# Altium project VENTUNOQ.PrjPcb (part 12 of 18)

## Sheet MICROCONTROLLER.SchDoc: Microcontroller
size A3; CompanyName: ARDUINO; Organization: ARDUINO; SheetNumber: 11; SheetTotal: 51; RevAuthor: Silvio Navaretti
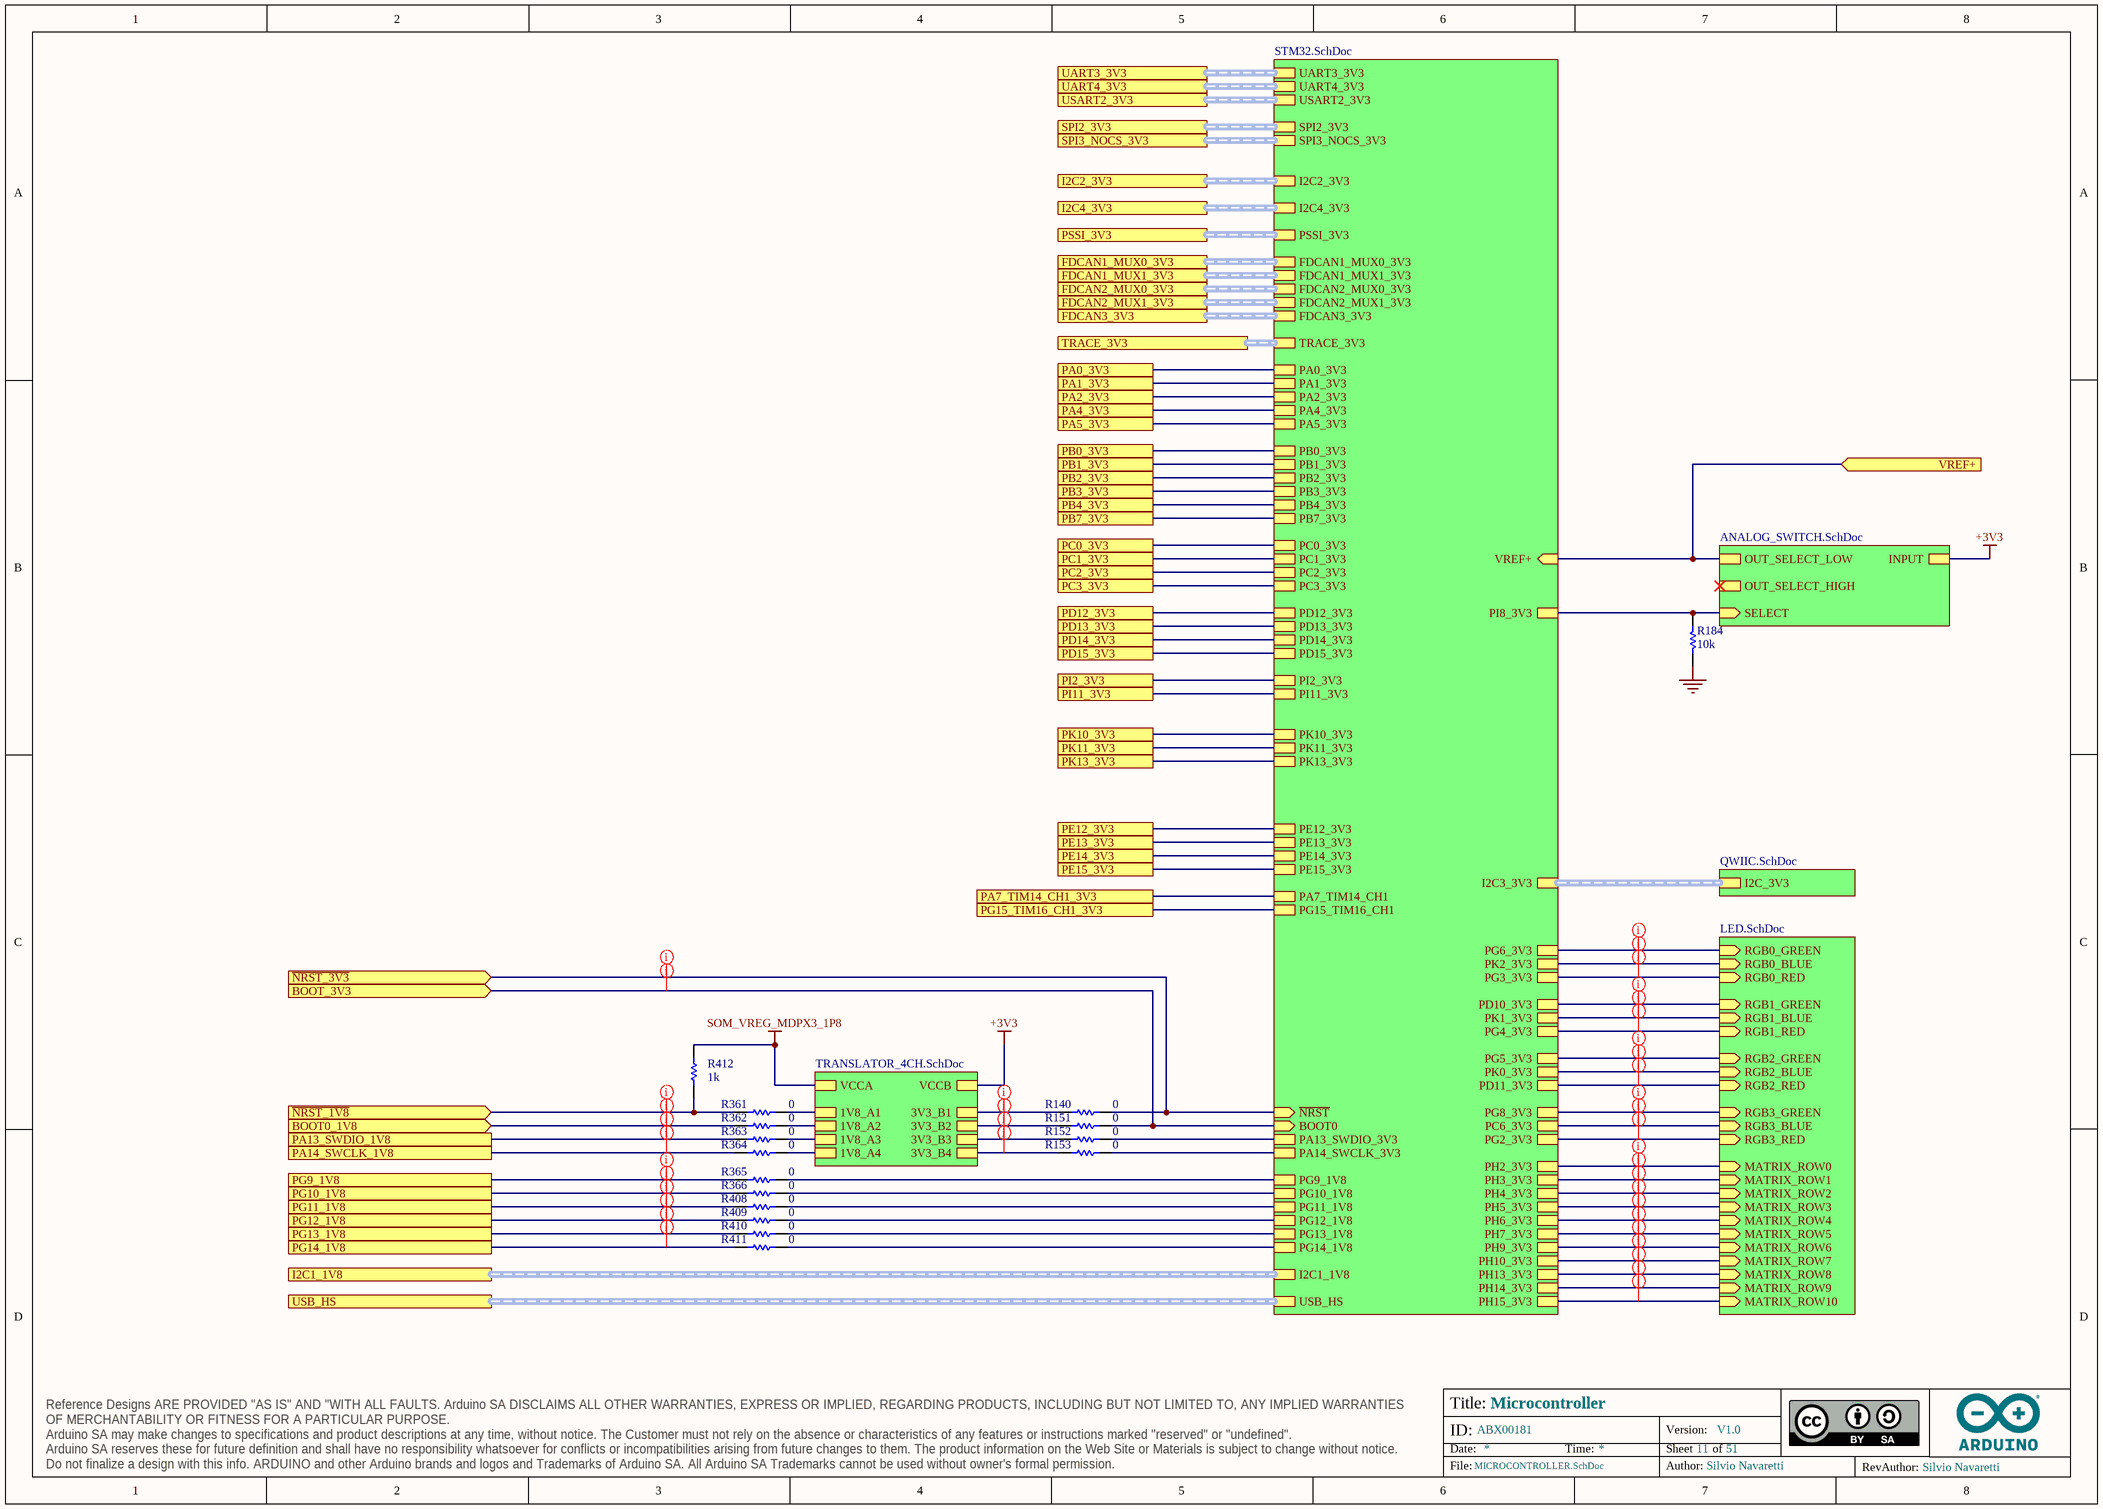
[diagram p36: MICROCONTROLLER.SchDoc]

### Parts
R140  value 0  [RES-0201]  (hidden comment: CRCW02010000Z0ED)
R151  value 0  [RES-0201]  (hidden comment: CRCW02010000Z0ED)
R152  value 0  [RES-0201]  (hidden comment: CRCW02010000Z0ED)
R153  value 0  [RES-0201]  (hidden comment: CRCW02010000Z0ED)
R184  value 10k  [RES-0201]  (hidden comment: RC0201FR-0710KL)
R361  value 0  [RES-0201]  (hidden comment: CRCW02010000Z0ED)
R362  value 0  [RES-0201]  (hidden comment: CRCW02010000Z0ED)
R363  value 0  [RES-0201]  (hidden comment: CRCW02010000Z0ED)
R364  value 0  [RES-0201]  (hidden comment: CRCW02010000Z0ED)
R365  value 0  [RES-0201]  (hidden comment: CRCW02010000Z0ED)
R366  value 0  [RES-0201]  (hidden comment: CRCW02010000Z0ED)
R408  value 0  [RES-0201]  (hidden comment: CRCW02010000Z0ED)
R409  value 0  [RES-0201]  (hidden comment: CRCW02010000Z0ED)
R410  value 0  [RES-0201]  (hidden comment: CRCW02010000Z0ED)
R411  value 0  [RES-0201]  (hidden comment: CRCW02010000Z0ED)
R412  value 1k  [RES-0201]  (hidden comment: RC0201FR-071KL)

### Sub-sheets
U_ANALOG_SWITCH = ANALOG_SWITCH.SchDoc: SELECT (in), OUT_SELECT_LOW, OUT_SELECT_HIGH, INPUT
U_LED = LED.SchDoc: RGB0_GREEN (in), RGB0_BLUE (in), RGB0_RED (in), RGB1_GREEN (in), RGB1_BLUE (in), RGB1_RED (in), RGB2_GREEN (in), RGB2_BLUE (in), RGB2_RED (in), RGB3_GREEN (in), RGB3_BLUE (in), RGB3_RED (in), MATRIX_ROW0 (in), MATRIX_ROW1 (in), MATRIX_ROW2 (in), MATRIX_ROW3 (in), MATRIX_ROW4 (in), MATRIX_ROW5 (in), MATRIX_ROW6 (in), MATRIX_ROW7 (in), MATRIX_ROW8 (in), MATRIX_ROW9 (in), MATRIX_ROW10 (in)
U_QWIIC = QWIIC.SchDoc: I2C_3V3 (harness I2C)
U_STM32 = STM32.SchDoc: USB_HS (harness SOM_MD_USB1), ~{NRST} (in), BOOT0 (in), UART3_3V3 (harness UART), PB2_3V3, PB3_3V3, FDCAN2_MUX0_3V3 (harness CAN), PB0_3V3, PB1_3V3, PB4_3V3, PB7_3V3, SPI2_3V3 (harness SPI), PA0_3V3, PA1_3V3, I2C2_3V3 (harness I2C), PA2_3V3, UART4_3V3 (harness UART), PSSI_3V3 (harness PSSI), PA4_3V3, PA5_3V3, PE12_3V3, PE13_3V3, PE14_3V3, PE15_3V3, FDCAN1_MUX0_3V3 (harness CAN), FDCAN2_MUX1_3V3 (harness CAN), PC0_3V3, PC1_3V3, PC2_3V3, PC3_3V3, PH2_3V3, PH3_3V3, PH4_3V3, PH5_3V3, PH6_3V3, PH7_3V3, PH9_3V3, PH13_3V3, PH14_3V3, PH15_3V3, VREF+ (in), SPI3_NOCS_3V3 (harness JSPI_SPI), I2C4_3V3 (harness I2C), PG9_1V8, PG10_1V8, PG11_1V8, PG12_1V8, PG13_1V8, PG14_1V8, I2C3_3V3 (harness I2C), I2C1_1V8 (harness I2C), PA13_SWDIO_3V3, PA14_SWCLK_3V3, TRACE_3V3 (harness MCU_TRACE), USART2_3V3 (harness UART), PA7_TIM14_CH1, PG15_TIM16_CH1, FDCAN3_3V3 (harness CAN), FDCAN1_MUX1_3V3 (harness CAN), PD12_3V3, PD13_3V3, PD14_3V3, PD15_3V3, PI2_3V3, PI11_3V3, PI8_3V3, PG2_3V3, PK0_3V3, PK1_3V3, PK2_3V3, PD10_3V3, PD11_3V3, PG3_3V3, PG4_3V3, PG5_3V3, PG6_3V3, PC6_3V3, PG8_3V3, PH10_3V3, PK13_3V3, PK10_3V3, PK11_3V3
U_TRANSLATOR_4CH = TRANSLATOR_4CH.SchDoc: 1V8_A1, 1V8_A2, 1V8_A3, 1V8_A4, 3V3_B1, 3V3_B2, 3V3_B3, 3V3_B4, VCCA, VCCB

### Ports
BOOT0_1V8 (in), BOOT_3V3 (in), FDCAN1_MUX0_3V3, FDCAN1_MUX1_3V3, FDCAN2_MUX0_3V3, FDCAN2_MUX1_3V3, FDCAN3_3V3, I2C1_1V8, I2C2_3V3, I2C4_3V3, PA0_3V3, PA1_3V3, PA2_3V3, PA4_3V3, PA5_3V3, PA7_TIM14_CH1_3V3, PA13_SWDIO_1V8, PA14_SWCLK_1V8, PB0_3V3, PB1_3V3, PB2_3V3, PB3_3V3, PB4_3V3, PB7_3V3, PC0_3V3, PC1_3V3, PC2_3V3, PC3_3V3, PD12_3V3, PD13_3V3, PD14_3V3, PD15_3V3, PE12_3V3, PE13_3V3, PE14_3V3, PE15_3V3, PG9_1V8, PG10_1V8, PG11_1V8, PG12_1V8, PG13_1V8, PG14_1V8, PG15_TIM16_CH1_3V3, PI2_3V3, PI11_3V3, PK10_3V3, PK11_3V3, PK13_3V3, PSSI_3V3, SPI2_3V3, SPI3_NOCS_3V3, TRACE_3V3, UART3_3V3, UART4_3V3, USART2_3V3, USB_HS, VREF+ (in), ~{NRST_1V8} (in), ~{NRST_3V3} (in)

### Nets
+3V3: sheet U_ANALOG_SWITCH/INPUT, sheet U_TRANSLATOR_4CH/VCCB
GND: R184.1
SOM_VREG_MDPX3_1P8: R412.1 ; sheet U_TRANSLATOR_4CH/VCCA
BOOT0: R151.1 ; port BOOT_3V3, sheet U_STM32/BOOT0
MD_GPIO_42: R408.2 ; port PG11_1V8
MD_GPIO_47: R362.2 ; port BOOT0_1V8
MD_GPIO_63: R409.2 ; port PG12_1V8
MD_GPIO_69: R365.2 ; port PG9_1V8
MD_GPIO_70: R363.2 ; port PA13_SWDIO_1V8
MD_GPIO_71: R364.2 ; port PA14_SWCLK_1V8
MD_GPIO_78: R361.2 R412.2 ; port ~{NRST_1V8}
MD_GPIO_92: R366.2 ; port PG10_1V8
MD_GPIO_95: R410.2 ; port PG13_1V8
MD_GPIO_96: R411.2 ; port PG14_1V8
NRST: R140.1 ; port ~{NRST_3V3}, sheet U_STM32/~{NRST}
PA0: port PA0_3V3, sheet U_STM32/PA0_3V3
PA1: port PA1_3V3, sheet U_STM32/PA1_3V3
PA2: port PA2_3V3, sheet U_STM32/PA2_3V3
PA4: port PA4_3V3, sheet U_STM32/PA4_3V3
PA5: port PA5_3V3, sheet U_STM32/PA5_3V3
PA7: port PA7_TIM14_CH1_3V3, sheet U_STM32/PA7_TIM14_CH1
PA13: R152.1 ; sheet U_STM32/PA13_SWDIO_3V3
PA14: R153.1 ; sheet U_STM32/PA14_SWCLK_3V3
PB0: port PB0_3V3, sheet U_STM32/PB0_3V3
PB1: port PB1_3V3, sheet U_STM32/PB1_3V3
PB2: port PB2_3V3, sheet U_STM32/PB2_3V3
PB3: port PB3_3V3, sheet U_STM32/PB3_3V3
PB4: port PB4_3V3, sheet U_STM32/PB4_3V3
PB7: port PB7_3V3, sheet U_STM32/PB7_3V3
PC0: port PC0_3V3, sheet U_STM32/PC0_3V3
PC1: port PC1_3V3, sheet U_STM32/PC1_3V3
PC2: port PC2_3V3, sheet U_STM32/PC2_3V3
PC3: port PC3_3V3, sheet U_STM32/PC3_3V3
PC6: sheet U_STM32/PC6_3V3, sheet U_LED/RGB3_BLUE
PD10: sheet U_STM32/PD10_3V3, sheet U_LED/RGB1_GREEN
PD11: sheet U_STM32/PD11_3V3, sheet U_LED/RGB2_RED
PD12: port PD12_3V3, sheet U_STM32/PD12_3V3
PD13: port PD13_3V3, sheet U_STM32/PD13_3V3
PD14: port PD14_3V3, sheet U_STM32/PD14_3V3
PD15: port PD15_3V3, sheet U_STM32/PD15_3V3
PE12: port PE12_3V3, sheet U_STM32/PE12_3V3
PE13: port PE13_3V3, sheet U_STM32/PE13_3V3
PE14: port PE14_3V3, sheet U_STM32/PE14_3V3
PE15: port PE15_3V3, sheet U_STM32/PE15_3V3
PG2: sheet U_STM32/PG2_3V3, sheet U_LED/RGB3_RED
PG3: sheet U_STM32/PG3_3V3, sheet U_LED/RGB0_RED
PG4: sheet U_STM32/PG4_3V3, sheet U_LED/RGB1_RED
PG5: sheet U_STM32/PG5_3V3, sheet U_LED/RGB2_GREEN
PG6: sheet U_STM32/PG6_3V3, sheet U_LED/RGB0_GREEN
PG8: sheet U_STM32/PG8_3V3, sheet U_LED/RGB3_GREEN
PG9: R365.1 ; sheet U_STM32/PG9_1V8
PG10: R366.1 ; sheet U_STM32/PG10_1V8
PG11: R408.1 ; sheet U_STM32/PG11_1V8
PG12: R409.1 ; sheet U_STM32/PG12_1V8
PG13: R410.1 ; sheet U_STM32/PG13_1V8
PG14: R411.1 ; sheet U_STM32/PG14_1V8
PG15: port PG15_TIM16_CH1_3V3, sheet U_STM32/PG15_TIM16_CH1
PH2: sheet U_STM32/PH2_3V3, sheet U_LED/MATRIX_ROW0
PH3: sheet U_STM32/PH3_3V3, sheet U_LED/MATRIX_ROW1
PH4: sheet U_STM32/PH4_3V3, sheet U_LED/MATRIX_ROW2
PH5: sheet U_STM32/PH5_3V3, sheet U_LED/MATRIX_ROW3
PH6: sheet U_STM32/PH6_3V3, sheet U_LED/MATRIX_ROW4
PH7: sheet U_STM32/PH7_3V3, sheet U_LED/MATRIX_ROW5
PH9: sheet U_STM32/PH9_3V3, sheet U_LED/MATRIX_ROW6
PH10: sheet U_STM32/PH10_3V3, sheet U_LED/MATRIX_ROW7
PH13: sheet U_STM32/PH13_3V3, sheet U_LED/MATRIX_ROW8
PH14: sheet U_STM32/PH14_3V3, sheet U_LED/MATRIX_ROW9
PH15: sheet U_STM32/PH15_3V3, sheet U_LED/MATRIX_ROW10
PI2: port PI2_3V3, sheet U_STM32/PI2_3V3
PI8: R184.2 ; sheet U_STM32/PI8_3V3, sheet U_ANALOG_SWITCH/SELECT
PI11: port PI11_3V3, sheet U_STM32/PI11_3V3
PK0: sheet U_STM32/PK0_3V3, sheet U_LED/RGB2_BLUE
PK1: sheet U_STM32/PK1_3V3, sheet U_LED/RGB1_BLUE
PK2: sheet U_STM32/PK2_3V3, sheet U_LED/RGB0_BLUE
PK10: port PK10_3V3, sheet U_STM32/PK10_3V3
PK11: port PK11_3V3, sheet U_STM32/PK11_3V3
PK13: port PK13_3V3, sheet U_STM32/PK13_3V3
NetC107_2: port VREF+, sheet U_STM32/VREF+, sheet U_ANALOG_SWITCH/OUT_SELECT_LOW
NetR140_2: R140.2 ; sheet U_TRANSLATOR_4CH/3V3_B1
NetR151_2: R151.2 ; sheet U_TRANSLATOR_4CH/3V3_B2
NetR152_2: R152.2 ; sheet U_TRANSLATOR_4CH/3V3_B3
NetR153_2: R153.2 ; sheet U_TRANSLATOR_4CH/3V3_B4
NetR361_1: R361.1 ; sheet U_TRANSLATOR_4CH/1V8_A1
NetR362_1: R362.1 ; sheet U_TRANSLATOR_4CH/1V8_A2
NetR363_1: R363.1 ; sheet U_TRANSLATOR_4CH/1V8_A3
NetR364_1: R364.1 ; sheet U_TRANSLATOR_4CH/1V8_A4

### Buses and harness runs
harness port FDCAN1_MUX0_3V3 = sheet U_STM32/FDCAN1_MUX0_3V3
harness port FDCAN1_MUX1_3V3 = sheet U_STM32/FDCAN1_MUX1_3V3
harness port FDCAN2_MUX0_3V3 = sheet U_STM32/FDCAN2_MUX0_3V3
harness port FDCAN2_MUX1_3V3 = sheet U_STM32/FDCAN2_MUX1_3V3
harness port FDCAN3_3V3 = sheet U_STM32/FDCAN3_3V3
harness port I2C1_1V8 = sheet U_STM32/I2C1_1V8
harness port I2C2_3V3 = sheet U_STM32/I2C2_3V3
harness port I2C4_3V3 = sheet U_STM32/I2C4_3V3
harness port PSSI_3V3 = sheet U_STM32/PSSI_3V3
harness port SPI2_3V3 = sheet U_STM32/SPI2_3V3
harness port SPI3_NOCS_3V3 = sheet U_STM32/SPI3_NOCS_3V3
harness port TRACE_3V3 = sheet U_STM32/TRACE_3V3
harness port UART3_3V3 = sheet U_STM32/UART3_3V3
harness port UART4_3V3 = sheet U_STM32/UART4_3V3
harness port USART2_3V3 = sheet U_STM32/USART2_3V3
harness port USB_HS = sheet U_STM32/USB_HS
harness sheet U_QWIIC/I2C_3V3 = sheet U_STM32/I2C3_3V3

### Layout directives
net class MICROCONTROLLER: BOOT0, MD_GPIO_42, MD_GPIO_47, MD_GPIO_63, MD_GPIO_69, MD_GPIO_70, MD_GPIO_71, MD_GPIO_78, MD_GPIO_92, MD_GPIO_95, MD_GPIO_96, NetR140_2, NetR151_2, NetR152_2, NetR153_2, NRST
net class MICROCONTROLLER_RGB: PC6, PD10, PD11, PG2, PG3, PG4, PG5, PG6, PG8, PK0, PK1, PK2
net class MICROCONTROLLER_MATRIX: PH2, PH3, PH4, PH5, PH6, PH7, PH9, PH10, PH13, PH14, PH15

### Notes on the sheet
- Title:
- ID:
- Date:
- Time:
- Version:
- Sheet
- of
- RevAuthor:
- Reference Designs ARE PROVIDED "AS IS" AND "WITH ALL FAULTS. Arduino SA DISCLAIMS ALL OTHER WARRANTIES, EXPRESS OR IMPLIED, REGARDING PRODUCTS, INCLUDING BUT NOT LIMITED TO, ANY IMPLIED WARRANTIES OF MERCHANTABILITY OR FITNESS FOR A PARTICULAR PURPOSE.
  Arduino SA may make changes to specifications and product descriptions at any time, without notice. The Customer must not rely on the absence or characteristics of any features or instructions marked "reserved" or "undefined".
  Arduino SA reserves these for future definition and shall have no responsibility whatsoever for conflicts or incompatibilities arising from future changes to them. The product information on the Web Site or Materials is subject to change without notice.
  Do not finalize a design with this info. ARDUINO and other Arduino brands and logos and Trademarks of Arduino SA. All Arduino SA Trademarks cannot be used without owner's formal permission.
- File:
- Author:

### Library data of the parts
R140 R151-R153 R361-R366 R408-R411 = R0140-A.21: RES CHIP 0201 0R; Manufacturer: Vishay; Temperature coefficient: 0ppm; Code Arduino: R0140; Power: 50mW; Tolerance: 0%; Technology: Thick film; Case Code (Imperial): 0201; Part Number: CRCW02010000Z0ED
R184 = R0145-A.21: RES CHIP 0201 10k 1% 1/20W; Manufacturer: Yageo; Power: 50mW; Temperature coefficient: 200ppm; Code Arduino: R0145; Manufacturer 2: Samsung Electro-Mechanics; Tolerance: 1%; Case Code (Imperial): 0201; Part Number: RC0201FR-0710KL; Technology: Thick film
R412 = R0195-A.22: RES CHIP 0201 1k 1% 1/20W; Manufacturer: Yageo; Power: 50mW; Temperature coefficient: 200ppm; Code Arduino: R0195; Tolerance: 1%; Case Code (Imperial): 0201; Part Number: RC0201FR-071KL; Technology: Thick film

## Sheet STM32.SchDoc: STM32
size A3; Author: Silvio Navaretti; CompanyName: ARDUINO; DrawnBy: Silvio Navaretti; Engineer: Silvio Navaretti; Organization: ARDUINO; SheetNumber: 12; SheetTotal: 51; RevAuthor: Silvio Navaretti
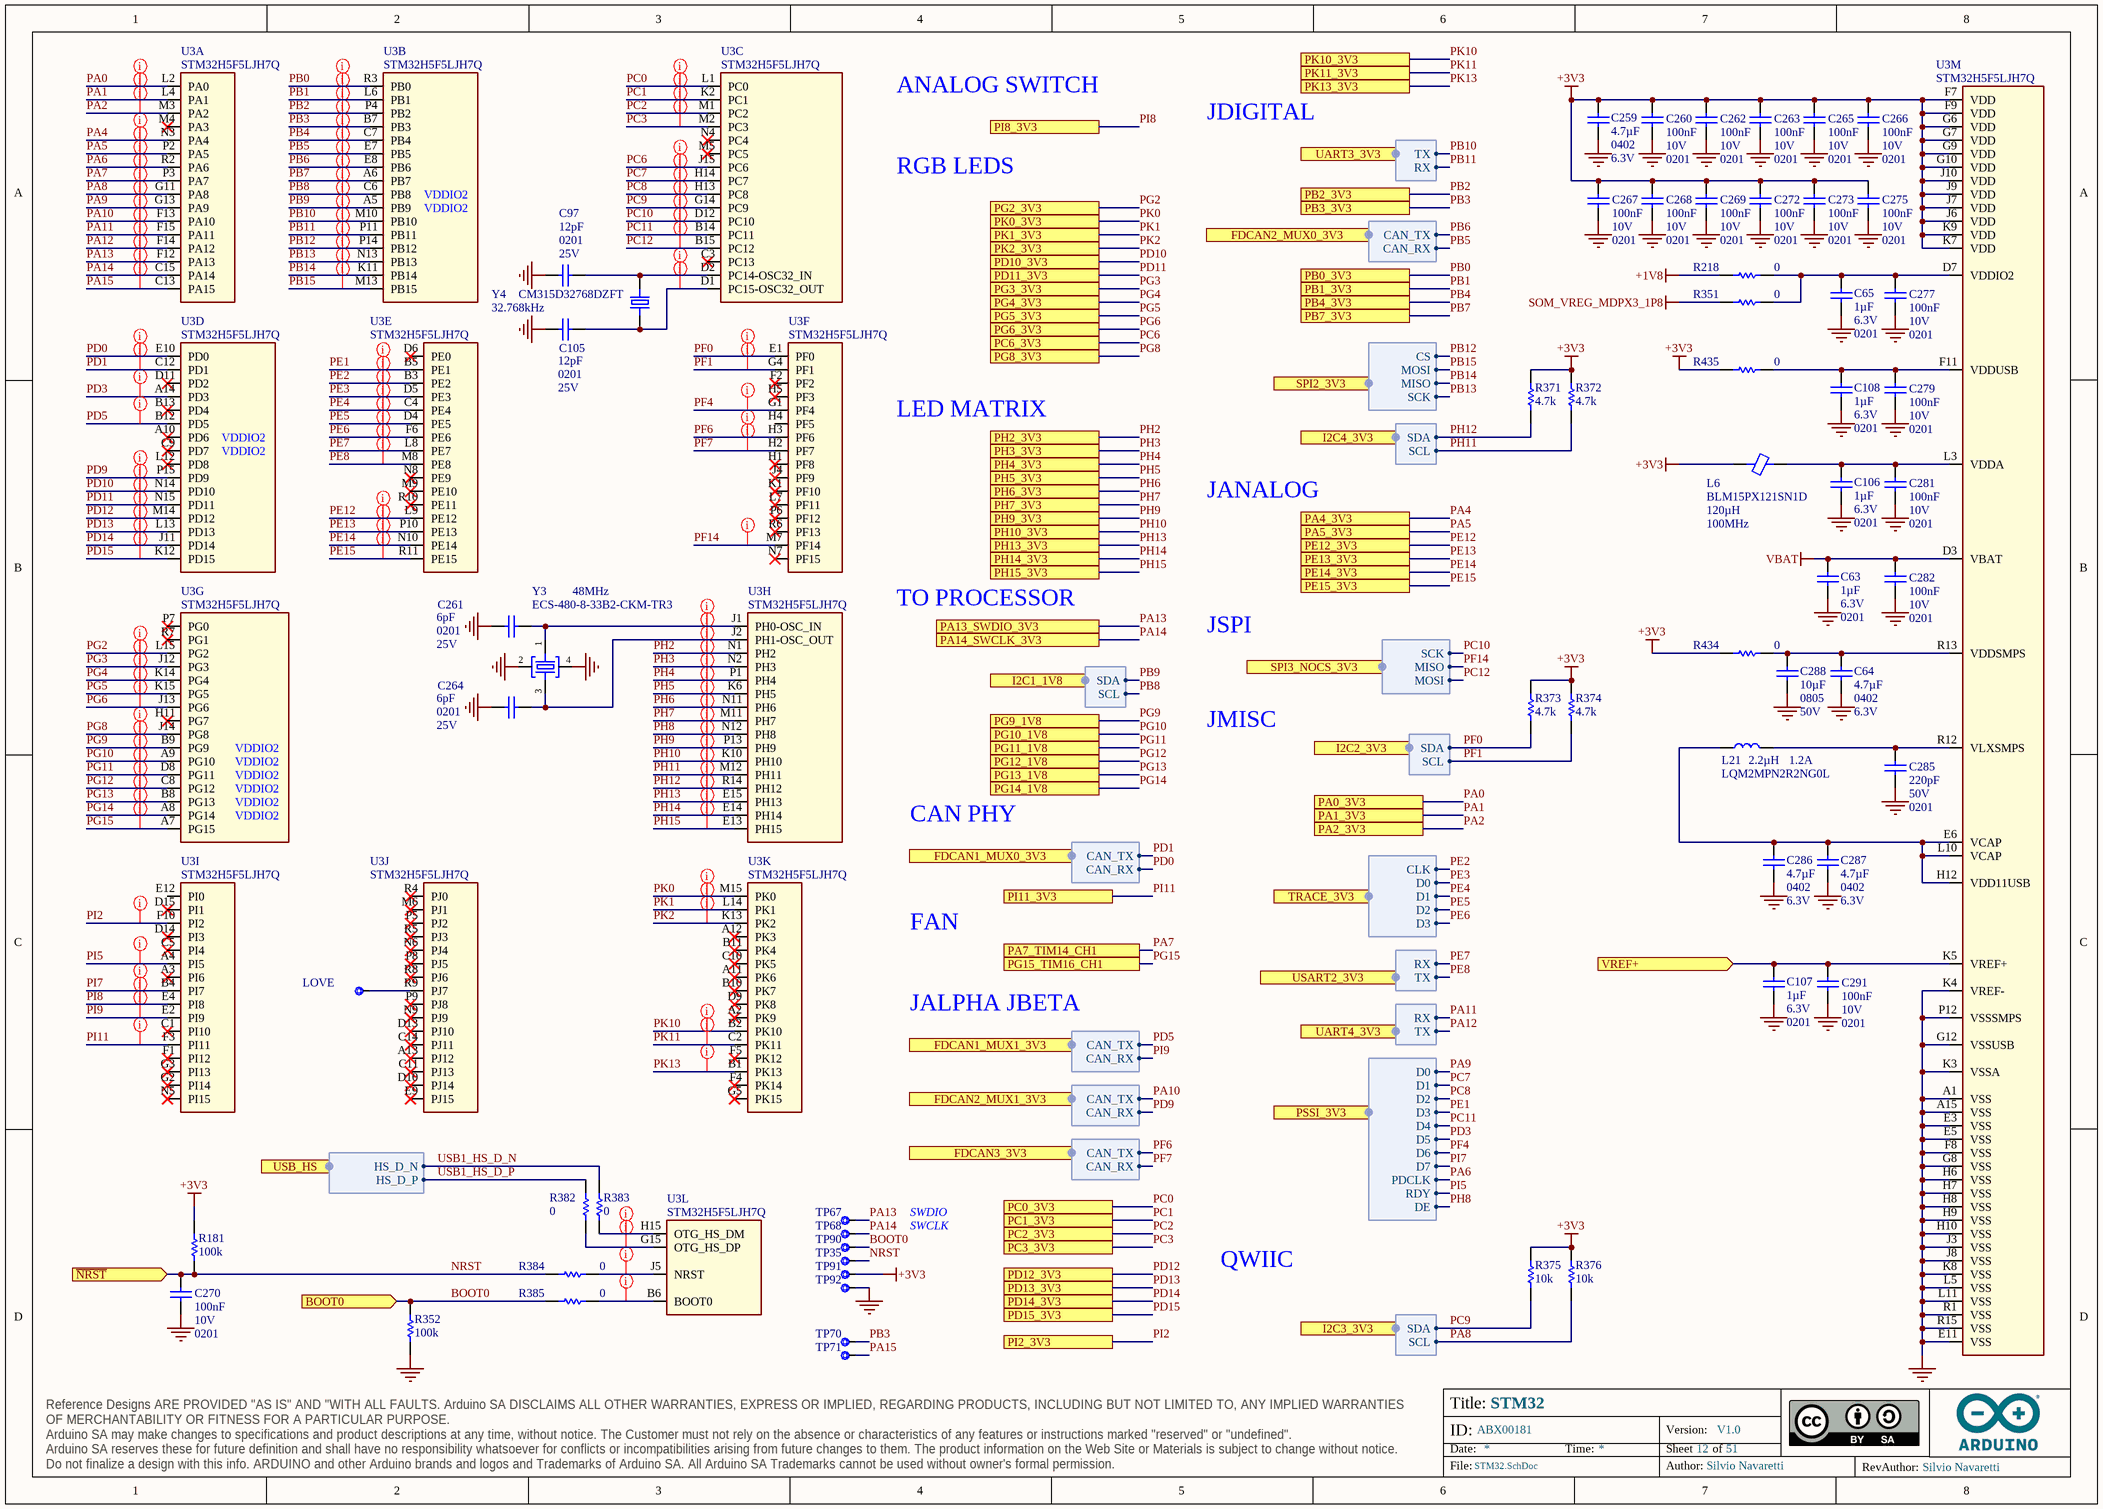
[diagram p37: STM32.SchDoc]

### Parts
C63  value 1µF  Voltage: 6.3V  Case Code (Imperial): 0201  [CAP-0201]  (hidden comment: GRM033R60J105MEA2D)
C64  value 4.7µF  Case Code (Imperial): 0402  Voltage: 6.3V  [CAP-0402]  (hidden comment: C1005A475M6R3NT)
C65  value 1µF  Voltage: 6.3V  Case Code (Imperial): 0201  [CAP-0201]  (hidden comment: GRM033R60J105MEA2D)
C97  value 12pF  Case Code (Imperial): 0201  Voltage: 25V  [CAP-0201]  (hidden comment: GRM0335C1E120JA01J)
C105  value 12pF  Case Code (Imperial): 0201  Voltage: 25V  [CAP-0201]  (hidden comment: GRM0335C1E120JA01J)
C106  value 1µF  Voltage: 6.3V  Case Code (Imperial): 0201  [CAP-0201]  (hidden comment: GRM033R60J105MEA2D)
C107  value 1µF  Voltage: 6.3V  Case Code (Imperial): 0201  [CAP-0201]  (hidden comment: GRM033R60J105MEA2D)
C108  value 1µF  Voltage: 6.3V  Case Code (Imperial): 0201  [CAP-0201]  (hidden comment: GRM033R60J105MEA2D)
C259  value 4.7µF  Case Code (Imperial): 0402  Voltage: 6.3V  [CAP-0402]  (hidden comment: C1005A475M6R3NT)
C260  value 100nF  Voltage: 10V  Case Code (Imperial): 0201  [CAP-0201]  (hidden comment: CL03A104KP3NNNC)
C261  value 6pF  Case Code (Imperial): 0201  Voltage: 25V  [CAP-0201]  (hidden comment: GRM0335C1E6R0CA01D)
C262  value 100nF  Voltage: 10V  Case Code (Imperial): 0201  [CAP-0201]  (hidden comment: CL03A104KP3NNNC)
C263  value 100nF  Voltage: 10V  Case Code (Imperial): 0201  [CAP-0201]  (hidden comment: CL03A104KP3NNNC)
C264  value 6pF  Case Code (Imperial): 0201  Voltage: 25V  [CAP-0201]  (hidden comment: GRM0335C1E6R0CA01D)
C265  value 100nF  Voltage: 10V  Case Code (Imperial): 0201  [CAP-0201]  (hidden comment: CL03A104KP3NNNC)
C266  value 100nF  Voltage: 10V  Case Code (Imperial): 0201  [CAP-0201]  (hidden comment: CL03A104KP3NNNC)
C267  value 100nF  Voltage: 10V  Case Code (Imperial): 0201  [CAP-0201]  (hidden comment: CL03A104KP3NNNC)
C268  value 100nF  Voltage: 10V  Case Code (Imperial): 0201  [CAP-0201]  (hidden comment: CL03A104KP3NNNC)
C269  value 100nF  Voltage: 10V  Case Code (Imperial): 0201  [CAP-0201]  (hidden comment: CL03A104KP3NNNC)
C270  value 100nF  Voltage: 10V  Case Code (Imperial): 0201  [CAP-0201]  (hidden comment: CL03A104KP3NNNC)
C272  value 100nF  Voltage: 10V  Case Code (Imperial): 0201  [CAP-0201]  (hidden comment: CL03A104KP3NNNC)
C273  value 100nF  Voltage: 10V  Case Code (Imperial): 0201  [CAP-0201]  (hidden comment: CL03A104KP3NNNC)
C275  value 100nF  Voltage: 10V  Case Code (Imperial): 0201  [CAP-0201]  (hidden comment: CL03A104KP3NNNC)
C277  value 100nF  Voltage: 10V  Case Code (Imperial): 0201  [CAP-0201]  (hidden comment: CL03A104KP3NNNC)
C279  value 100nF  Voltage: 10V  Case Code (Imperial): 0201  [CAP-0201]  (hidden comment: CL03A104KP3NNNC)
C281  value 100nF  Voltage: 10V  Case Code (Imperial): 0201  [CAP-0201]  (hidden comment: CL03A104KP3NNNC)
C282  value 100nF  Voltage: 10V  Case Code (Imperial): 0201  [CAP-0201]  (hidden comment: CL03A104KP3NNNC)
C285  value 220pF  Voltage: 50V  Case Code (Imperial): 0201  [CAP-0201]  (hidden comment: GRM033R71H221KA12D)
C286  value 4.7µF  Case Code (Imperial): 0402  Voltage: 6.3V  [CAP-0402]  (hidden comment: C1005A475M6R3NT)
C287  value 4.7µF  Case Code (Imperial): 0402  Voltage: 6.3V  [CAP-0402]  (hidden comment: C1005A475M6R3NT)
C288  value 10µF  Case Code (Imperial): 0805  Voltage: 50V  [CAP-0805]  (hidden comment: GRM21BR61H106ME43L)
C291  value 100nF  Voltage: 10V  Case Code (Imperial): 0201  [CAP-0201]  (hidden comment: CL03A104KP3NNNC)
L6  BLM15PX121SN1D  Inductance: 120µH  Test Frequency: 100MHz  [L-0402]
L21  LQM2MPN2R2NG0L  Current: 1.2A  Inductance: 2.2µH  [LQM2MPN2R2NG0L]
LOVE  Test point 1.00mm  [TP-1.00MM]  (value not drawn)  (no BOM)
R181  value 100k  [RES-0201]  (hidden comment: RC0201FR-07100KL)
R218  value 0  [RES-0201]  (hidden comment: CRCW02010000Z0ED)
R351  value 0  [RES-0201]  (hidden comment: CRCW02010000Z0ED)
R352  value 100k  [RES-0201]  (hidden comment: RC0201FR-07100KL)
R371  value 4.7k  [RES-0201]  (hidden comment: RC0201FR-074K7L)
R372  value 4.7k  [RES-0201]  (hidden comment: RC0201FR-074K7L)
R373  value 4.7k  [RES-0201]  (hidden comment: RC0201FR-074K7L)
R374  value 4.7k  [RES-0201]  (hidden comment: RC0201FR-074K7L)
R375  value 10k  [RES-0201]  (hidden comment: RC0201FR-0710KL)
R376  value 10k  [RES-0201]  (hidden comment: RC0201FR-0710KL)
R382  value 0  [RES-0201]  (hidden comment: CRCW02010000Z0ED)
R383  value 0  [RES-0201]  (hidden comment: CRCW02010000Z0ED)
R384  value 0  [RES-0201]  (hidden comment: CRCW02010000Z0ED)
R385  value 0  [RES-0201]  (hidden comment: CRCW02010000Z0ED)
R434  value 0  [RES-0201]  (hidden comment: CRCW02010000Z0ED)
R435  value 0  [RES-0201]  (hidden comment: CRCW02010000Z0ED)
TP35  Test point 1.00mm  [TP-1.00MM]  (value not drawn)  (no BOM)
TP67  Test point 1.00mm  [TP-1.00MM]  (value not drawn)  (no BOM)
TP68  Test point 1.00mm  [TP-1.00MM]  (value not drawn)  (no BOM)
TP70  Test point 1.00mm  [TP-1.00MM]  (value not drawn)  (no BOM)
TP71  Test point 1.00mm  [TP-1.00MM]  (value not drawn)  (no BOM)
TP90  Test point 1.00mm  [TP-1.00MM]  (value not drawn)  (no BOM)
TP91  Test point 1.00mm  [TP-1.00MM]  (value not drawn)  (no BOM)
TP92  Test point 1.00mm  [TP-1.00MM]  (value not drawn)  (no BOM)
U3  STM32H5F5LJH7Q  [BGA225C80P15X15_1300X1300X120]  (parts A,B,C,D,E,F,G,H,I,J,K,L,M of 13)
Y3  ECS-480-8-33B2-CKM-TR3  Frequency: 48MHz  [CRYSTAL3.2X2.5]
Y4  CM315D32768DZFT  Frequency: 32.768kHz  [ABS07]

### Ports
BOOT0 (in), FDCAN1_MUX0_3V3 (harness CAN), FDCAN1_MUX1_3V3 (harness CAN), FDCAN2_MUX0_3V3 (harness CAN), FDCAN2_MUX1_3V3 (harness CAN), FDCAN3_3V3 (harness CAN), I2C1_1V8 (harness I2C), I2C2_3V3 (harness I2C), I2C3_3V3 (harness I2C), I2C4_3V3 (harness I2C), PA0_3V3, PA1_3V3, PA2_3V3, PA4_3V3, PA5_3V3, PA7_TIM14_CH1, PA13_SWDIO_3V3, PA14_SWCLK_3V3, PB0_3V3, PB1_3V3, PB2_3V3, PB3_3V3, PB4_3V3, PB7_3V3, PC0_3V3, PC1_3V3, PC2_3V3, PC3_3V3, PC6_3V3, PD10_3V3, PD11_3V3, PD12_3V3, PD13_3V3, PD14_3V3, PD15_3V3, PE12_3V3, PE13_3V3, PE14_3V3, PE15_3V3, PG2_3V3, PG3_3V3, PG4_3V3, PG5_3V3, PG6_3V3, PG8_3V3, PG9_1V8, PG10_1V8, PG11_1V8, PG12_1V8, PG13_1V8, PG14_1V8, PG15_TIM16_CH1, PH2_3V3, PH3_3V3, PH4_3V3, PH5_3V3, PH6_3V3, PH7_3V3, PH9_3V3, PH10_3V3, PH13_3V3, PH14_3V3, PH15_3V3, PI2_3V3, PI8_3V3, PI11_3V3, PK0_3V3, PK1_3V3, PK2_3V3, PK10_3V3, PK11_3V3, PK13_3V3, PSSI_3V3 (harness PSSI), SPI2_3V3 (harness SPI), SPI3_NOCS_3V3 (harness JSPI_SPI), TRACE_3V3 (harness MCU_TRACE), UART3_3V3 (harness UART), UART4_3V3 (harness UART), USART2_3V3 (harness UART), USB_HS (harness SOM_MD_USB1), VREF+ (in), ~{NRST} (in)

### Harnesses
SPI: SCK, MISO, MOSI, CS
UART: TX, RX
I2C: SDA, SCL
CAN: CAN_TX, CAN_RX
PSSI: D0, D1, D2, D3, D4, D5, D6, D7, PDCLK, RDY, DE
JSPI_SPI: SCK, MISO, MOSI
MCU_TRACE: CLK, D0, D1, D2, D3
SOM_MD_USB1: HS_D_P, HS_D_N

### Nets
+1V8: R218.1
+3V3: C259.1 C260.2 C262.2 C263.2 C265.2 C266.2 C267.2 C268.2 C269.2 C272.2 C273.2 C275.2 L6.1 R181.2 R371.2 R372.2 R373.2 R374.2 R375.2 R376.2 R434.1 R435.1 TP91.X U3.F7(VDD) U3.F9(VDD) U3.G6(VDD) U3.G7(VDD) U3.G9(VDD) U3.G10(VDD) U3.J6(VDD) U3.J7(VDD) U3.J9(VDD) U3.J10(VDD) U3.K7(VDD) U3.K9(VDD)
GND: C63.1 C64.2 C65.1 C97.2 C105.2 C106.1 C107.1 C108.1 C259.2 C260.1 C261.2 C262.1 C263.1 C264.2 C265.1 C266.1 C267.1 C268.1 C269.1 C270.1 C272.1 C273.1 C275.1 C277.1 C279.1 C281.1 C282.1 C285.1 C286.2 C287.2 C288.2 C291.1 R352.1 TP92.X U3.A1(VSS) U3.A15(VSS) U3.E3(VSS) U3.E5(VSS) U3.E11(VSS) U3.F8(VSS) U3.G8(VSS) U3.G12(VSSUSB) U3.H6(VSS) U3.H7(VSS) U3.H8(VSS) U3.H9(VSS) U3.H10(VSS) U3.J3(VSS) U3.J8(VSS) U3.K3(VSSA) U3.K4(VREF-) U3.K8(VSS) U3.L5(VSS) U3.L11(VSS) U3.P12(VSSSMPS) U3.R1(VSS) U3.R15(VSS) Y3.2 Y3.4
SOM_VREG_MDPX3_1P8: R351.1
VBAT: C63.2 C282.2 U3.D3(VBAT)
BOOT0: R352.2 R385.1 TP90.X ; port BOOT0
NRST: C270.2 R181.1 R384.1 TP35.X ; port ~{NRST}
PA0: U3.L2(PA0) ; port PA0_3V3
PA1: U3.L4(PA1) ; port PA1_3V3
PA2: U3.M3(PA2) ; port PA2_3V3
PA4: U3.N3(PA4) ; port PA4_3V3
PA5: U3.P2(PA5) ; port PA5_3V3
PA6: U3.R2(PA6) ; port PSSI_3V3.PDCLK
PA7: U3.P3(PA7) ; port PA7_TIM14_CH1
PA8: R376.1 U3.G11(PA8) ; port I2C3_3V3.SCL
PA9: U3.G13(PA9) ; port PSSI_3V3.D0
PA10: U3.F13(PA10) ; port FDCAN2_MUX1_3V3.CAN_TX
PA11: U3.F15(PA11) ; port UART4_3V3.RX
PA12: U3.F14(PA12) ; port UART4_3V3.TX
PA13: TP67.X U3.F12(PA13) ; port PA13_SWDIO_3V3
PA14: TP68.X U3.C15(PA14) ; port PA14_SWCLK_3V3
PA15: TP71.X U3.C13(PA15)  [project net PA15_12]
PB0: U3.R3(PB0) ; port PB0_3V3
PB1: U3.L6(PB1) ; port PB1_3V3
PB2: U3.P4(PB2) ; port PB2_3V3
PB3: TP70.X U3.B7(PB3) ; port PB3_3V3
PB4: U3.C7(PB4) ; port PB4_3V3
PB5: U3.E7(PB5) ; port FDCAN2_MUX0_3V3.CAN_RX
PB6: U3.E8(PB6) ; port FDCAN2_MUX0_3V3.CAN_TX
PB7: U3.A6(PB7) ; port PB7_3V3
PB8: U3.C6(PB8) ; port I2C1_1V8.SCL  [project net MD_CCI_I2C3.SCL]
PB9: U3.A5(PB9) ; port I2C1_1V8.SDA  [project net MD_CCI_I2C3.SDA]
PB10: U3.M10(PB10) ; port UART3_3V3.TX
PB11: U3.P11(PB11) ; port UART3_3V3.RX
PB12: U3.P14(PB12) ; port SPI2_3V3.CS
PB13: U3.N13(PB13) ; port SPI2_3V3.SCK
PB14: U3.K11(PB14) ; port SPI2_3V3.MISO
PB15: U3.M13(PB15) ; port SPI2_3V3.MOSI
PC0: U3.L1(PC0) ; port PC0_3V3
PC1: U3.K2(PC1) ; port PC1_3V3
PC2: U3.M1(PC2) ; port PC2_3V3
PC3: U3.M2(PC3) ; port PC3_3V3
PC6: U3.J15(PC6) ; port PC6_3V3
PC7: U3.H14(PC7) ; port PSSI_3V3.D1
PC8: U3.H13(PC8) ; port PSSI_3V3.D2
PC9: R375.1 U3.G14(PC9) ; port I2C3_3V3.SDA
PC10: U3.D12(PC10) ; port SPI3_NOCS_3V3.SCK
PC11: U3.B14(PC11) ; port PSSI_3V3.D4
PC12: U3.B15(PC12) ; port SPI3_NOCS_3V3.MOSI
PD0: U3.E10(PD0) ; port FDCAN1_MUX0_3V3.CAN_RX
PD1: U3.C12(PD1) ; port FDCAN1_MUX0_3V3.CAN_TX
PD3: U3.A14(PD3) ; port PSSI_3V3.D5
PD5: U3.B12(PD5) ; port FDCAN1_MUX1_3V3.CAN_TX
PD9: U3.P15(PD9) ; port FDCAN2_MUX1_3V3.CAN_RX
PD10: U3.N14(PD10) ; port PD10_3V3
PD11: U3.N15(PD11) ; port PD11_3V3
PD12: U3.M14(PD12) ; port PD12_3V3
PD13: U3.L13(PD13) ; port PD13_3V3
PD14: U3.J11(PD14) ; port PD14_3V3
PD15: U3.K12(PD15) ; port PD15_3V3
PE1: U3.B5(PE1) ; port PSSI_3V3.D3
PE2: U3.B3(PE2) ; port TRACE_3V3.CLK
PE3: U3.D5(PE3) ; port TRACE_3V3.D0
PE4: U3.C4(PE4) ; port TRACE_3V3.D1
PE5: U3.D4(PE5) ; port TRACE_3V3.D2
PE6: U3.F6(PE6) ; port TRACE_3V3.D3
PE7: U3.L8(PE7) ; port USART2_3V3.RX
PE8: U3.M8(PE8) ; port USART2_3V3.TX
PE12: U3.L9(PE12) ; port PE12_3V3
PE13: U3.P10(PE13) ; port PE13_3V3
PE14: U3.N10(PE14) ; port PE14_3V3
PE15: U3.R11(PE15) ; port PE15_3V3
PF0: R373.1 U3.E1(PF0) ; port I2C2_3V3.SDA
PF1: R374.1 U3.G4(PF1) ; port I2C2_3V3.SCL
PF4: U3.G1(PF4) ; port PSSI_3V3.D6
PF6: U3.H3(PF6) ; port FDCAN3_3V3.CAN_TX
PF7: U3.H2(PF7) ; port FDCAN3_3V3.CAN_RX
PF14: U3.M7(PF14) ; port SPI3_NOCS_3V3.MISO
PG2: U3.L15(PG2) ; port PG2_3V3
PG3: U3.J12(PG3) ; port PG3_3V3
PG4: U3.K14(PG4) ; port PG4_3V3
PG5: U3.K15(PG5) ; port PG5_3V3
PG6: U3.J13(PG6) ; port PG6_3V3
PG8: U3.J14(PG8) ; port PG8_3V3
PG9: U3.B9(PG9) ; port PG9_1V8
PG10: U3.A9(PG10) ; port PG10_1V8
PG11: U3.D8(PG11) ; port PG11_1V8
PG12: U3.C8(PG12) ; port PG12_1V8
PG13: U3.B8(PG13) ; port PG13_1V8
PG14: U3.A8(PG14) ; port PG14_1V8
PG15: U3.A7(PG15) ; port PG15_TIM16_CH1
PH2: U3.N1(PH2) ; port PH2_3V3
PH3: U3.N2(PH3) ; port PH3_3V3
PH4: U3.P1(PH4) ; port PH4_3V3
PH5: U3.K6(PH5) ; port PH5_3V3
PH6: U3.N11(PH6) ; port PH6_3V3
PH7: U3.M11(PH7) ; port PH7_3V3
PH8: U3.N12(PH8) ; port PSSI_3V3.DE
PH9: U3.P13(PH9) ; port PH9_3V3
PH10: U3.K10(PH10) ; port PH10_3V3
PH11: R372.1 U3.M12(PH11) ; port I2C4_3V3.SCL
PH12: R371.1 U3.R14(PH12) ; port I2C4_3V3.SDA
PH13: U3.E15(PH13) ; port PH13_3V3
PH14: U3.E14(PH14) ; port PH14_3V3
PH15: U3.E13(PH15) ; port PH15_3V3
PI2: U3.F10(PI2) ; port PI2_3V3
PI5: U3.A4(PI5) ; port PSSI_3V3.RDY
PI7: U3.B4(PI7) ; port PSSI_3V3.D7
PI8: U3.E4(PI8) ; port PI8_3V3
PI9: U3.E2(PI9) ; port FDCAN1_MUX1_3V3.CAN_RX
PI11: U3.F3(PI11) ; port PI11_3V3
PK0: U3.M15(PK0) ; port PK0_3V3
PK1: U3.L14(PK1) ; port PK1_3V3
PK2: U3.K13(PK2) ; port PK2_3V3
PK10: U3.B2(PK10) ; port PK10_3V3
PK11: U3.C2(PK11) ; port PK11_3V3
PK13: U3.B1(PK13) ; port PK13_3V3
USB1_HS_D_N: R383.1 ; port USB_HS.HS_D_N  [project net MD_USB1_2.0.HS_D_N]
USB1_HS_D_P: R382.1 ; port USB_HS.HS_D_P  [project net MD_USB1_2.0.HS_D_P]
NetC64_1: C64.1 C288.1 R434.2 U3.R13(VDDSMPS)
NetC65_2: C65.2 C277.2 R218.2 R351.2 U3.D7(VDDIO2)
NetC97_1: C97.1 U3.D2(PC14-OSC32_IN) Y4.2
NetC105_1: C105.1 U3.D1(PC15-OSC32_OUT) Y4.1
NetC106_2: C106.2 C281.2 L6.2 U3.L3(VDDA)
NetC107_2: C107.2 C291.2 U3.K5(VREF+) ; port VREF+
NetC108_2: C108.2 C279.2 R435.2 U3.F11(VDDUSB)
NetC261_1: C261.1 U3.J1(PH0-OSC_IN) Y3.1
NetC264_1: C264.1 U3.J2(PH1-OSC_OUT) Y3.3
NetC285_2: C285.2 L21.2 U3.R12(VLXSMPS)
NetC286_1: C286.1 C287.1 L21.1 U3.E6(VCAP) U3.H12(VDD11USB) U3.L10(VCAP)
NetLOVE_X: LOVE.X U3.R9(PJ7)
NetR382_2: R382.2 U3.G15(OTG_HS_DP)
NetR383_2: R383.2 U3.H15(OTG_HS_DM)
NetR384_2: R384.2 U3.J5(NRST)
NetR385_2: R385.2 U3.B6(BOOT0)

Not connected (* = marked no-connect by the designer): U3 A2(PK9)* A3(PI6)* A10(PD6)* A11(PK6)* A12(PK3)* A13(PJ12)* B10(PK7)* B11(PK4)* B13(PD4)* C1(PI10)* C3(PC13)* C5(PI4)* C9(PD7)* C10(PK5)* C11(PJ13)* C14(PJ11)* D6(PE0)* D9(PK8)* D10(PJ14)* D11(PD2)* D13(PJ10)* D14(PI3)* D15(PI1)* E9(PJ15)* E12(PI0) F1(PI12)* F2(PF2)* F4(PK14)* F5(PK12)* G2(PI14)* G3(PI13)* G5(PK15)* H1(PF8)* H4(PF5) H5(PF3)* H11(PG7)* J4(PF9)* K1(PF10)* L7(PF11)* L12(PD8)* M4(PA3)* M5(PC5)* M6(PJ1)* M9(PE10)* N4(PC4)* N5(PI15)* N6(PJ4)* N7(PF15)* N8(PE9)* N9(PJ9)* P5(PJ2)* P6(PF12)* P7(PG0)* P8(PJ5)* P9(PJ8)* R4(PJ0)* R5(PJ3)* R6(PF13)* R7(PG1)* R8(PJ6)* R10(PE11)*

### Layout directives
net class MICROCONTROLLER: MD_CCI_I2C3.SCL, MD_CCI_I2C3.SDA, NetC97_1, NetC105_1, NetC261_1, NetC264_1, NetR382_2, NetR383_2, NetR384_2, NetR385_2, PA0, PA1, PA2, PA4, PA5, PA6, PA7, PA8, PA9, PA10, PA11, PA12, PA13, PA14, PA15_12, PB0, PB1, PB2, PB3, PB4, PB5, PB6, PB7, PB10, PB11, PB12, PB13, PB14, PB15, PC0, PC1, PC2, PC3, PC6, PC7, PC8, PC9, PC10, PC11, PC12, PD0, PD1, PD3, PD5, PD9, PD10, PD11, PD12, PD13, PD14, PD15, PE1, PE2, PE3, PE4, PE5, PE6, PE7, PE8, PE12, PE13, PE14, PE15, PF0, PF1, PF4, PF6, PF7, PF14, PG2, PG3, PG4, PG5, PG6, PG8, PG9, PG10, PG11, PG12, PG13, PG14, PG15, PH2, PH3, PH4, PH5, PH6, PH7, PH8, PH9, PH10, PH11, PH12, PH13, PH14, PH15, PI2, PI5, PI7, PI8, PI9, PI11, PK0, PK1, PK2, PK10, PK11, PK13

### Notes on the sheet
- ANALOG SWITCH
- RGB LEDS
- JDIGITAL
- LED MATRIX
- JANALOG
- TO PROCESSOR
- JSPI
- JMISC
- CAN PHY
- FAN
- JALPHA JBETA
- SWDIO
- SWCLK
- QWIIC
- Title:
- ID:
- Date:
- Time:
- Version:
- Sheet
- of
- RevAuthor:
- Reference Designs ARE PROVIDED "AS IS" AND "WITH ALL FAULTS. Arduino SA DISCLAIMS ALL OTHER WARRANTIES, EXPRESS OR IMPLIED, REGARDING PRODUCTS, INCLUDING BUT NOT LIMITED TO, ANY IMPLIED WARRANTIES OF MERCHANTABILITY OR FITNESS FOR A PARTICULAR PURPOSE.
  Arduino SA may make changes to specifications and product descriptions at any time, without notice. The Customer must not rely on the absence or characteristics of any features or instructions marked "reserved" or "undefined".
  Arduino SA reserves these for future definition and shall have no responsibility whatsoever for conflicts or incompatibilities arising from future changes to them. The product information on the Web Site or Materials is subject to change without notice.
  Do not finalize a design with this info. ARDUINO and other Arduino brands and logos and Trademarks of Arduino SA. All Arduino SA Trademarks cannot be used without owner's formal permission.
- File:
- Author:

### Library data of the parts
C63 C65 C106-C108 = C0002-A.15: CAP CHIP 0201 1uF 20% 6.3V X5R; Manufacturer: Murata; Code Arduino: A5520; Tolerance: 20%; Dielectric: X5R; Part Number: GRM033R60J105MEA2D; Technology: Ceramic
C64 C259 C286 C287 = C0037-A.14: CAP CHIP 0402 4.7uF 20% 6V3 X5R; Manufacturer: Hottech; Code Arduino: 0833; Dielectric: X5R; Technology: Ceramic; Part Number: C1005A475M6R3NT; Manufacturer 2: Samsung Electro-Mechanics; Tolerance: 20%; Manufacturer 3: Murata Electronics; Part number 3: GRM155R60J475ME47D; Part number 2: CL05A475KQ5NRNC
C97 C105 = C0003-A.15: CAP CHIP 0201 12pF 5% 25V C0G; Manufacturer: Murata; Code Arduino: C0003; Technology: Ceramic; Part Number: GRM0335C1E120JA01J; Tolerance: 5%; Dielectric: C0G
C260 C262 C263 C265-C270 C272 C273 C275 C277 C279 C281 C282 C291 = C0113-A.6: CAP CHIP 0201 100nF 10% 10V X5R; Manufacturer: Samsung Electro-Mechanics; Code Arduino: C0113; Technology: Ceramic; Part Number: CL03A104KP3NNNC; Dielectric: X5R; Tolerance: 10%
C261 C264 = C0203-A.1: CAP CHIP 0201 6pF 0.25pF 25V C0G; Manufacturer: Murata; Code Arduino: C0203; Technology: Ceramic; Part Number: GRM0335C1E6R0CA01D; Tolerance: 0.25pF; Dielectric: C0G
C285 = C0202-A.1: CAP CHIP 0201 220pF 10% 50V X7R; Manufacturer: Murata; Code Arduino: C0202; Technology: Ceramic; Part Number: GRM033R71H221KA12D; Dielectric: X7R; Tolerance: 10%
C288 = C0158-A.3: CAP CHIP 0805 10uF 20% 50V X5R; Manufacturer: Murata Electronics; Code Arduino: C0158; Tolerance: 20%; Dielectric: X5R; Technology: SMD; Part Number: GRM21BR61H106ME43L
L6 = I0028-A.10: FERRITE SMD 0402 120Ohm 25% 100MHz Ferrite 2A; Manufacturer: Murata; DC Resistance (DCR): 55mR; Code Arduino: I0028; Value: 120µH; Device Type: Ferrite; Packaging: Tape and Reel; Case Code (Imperial): 0402; Max DC Current: 2A; Case Code (Metric): 1005; Package Quantity: 10000; Current: 2A; Max Operating Temperature: 125°C; Tolerance: 25%; Min Operating Temperature: -55°C; Part Number: BLM15PX121SN1D
L21 = I0019-A.10: INDUCTOR SMD 0806 2.2uH 1.2A; Manufacturer: Murata; DC Resistance (DCR): 138mR; Tolerance: 30%; Test Frequency: 1MHz; Code Arduino: A5528; Case Code (Imperial): 0806; Package Quantity: 1; Part Number: LQM2MPN2R2NG0L; Case Code (Metric): 2016; Device Type: Inductor; Min Operating Temperature: -55°C; Packaging: Tape and Reel; Max DC Current: 1.2A; Max Operating Temperature: 125°C
LOVE = UT0013-A.6: Manufacturer: This is not a component; Source: ut.SchLib; Design Item ID: CMP-018-0005-A.3; Pin Count: 1; Part Number: This is not a component; Code Arduino: This is not a component
R181 R352 = R0146-A.21: RES CHIP 0201 100k 1% 1/20W; Manufacturer: Yageo; Power: 50mW; Temperature coefficient: 200ppm; Code Arduino: R0146; Manufacturer 2: Samsung Electro-Mechanics; Tolerance: 1%; Case Code (Imperial): 0201; Part Number: RC0201FR-07100KL; Technology: Thick film
R218 R351 R382-R385 R434 R435 = R0140-A.21: as R140 on sheet MICROCONTROLLER; Technology: Thick film; Case Code (Imperial): 0201; Part Number: CRCW02010000Z0ED
R371-R374 = R0151-A.21: RES CHIP 0201 4k7 1% 1/20W; Manufacturer: Yageo; Power: 50mW; Temperature coefficient: 200ppm; Code Arduino: A5521; Tolerance: 1%; Case Code (Imperial): 0201; Part Number: RC0201FR-074K7L; Technology: Thick film
R375 R376 = R0145-A.21: as R184 on sheet MICROCONTROLLER; Manufacturer 2: Samsung Electro-Mechanics; Tolerance: 1%; Case Code (Imperial): 0201; Part Number: RC0201FR-0710KL; Technology: Thick film
TP35 TP67 TP68 TP70 TP71 TP90-TP92 = UT0013-A.6: Part Number: This is not a component; Design Item ID: CMP-018-0005-A.3; Source: ut.SchLib; Manufacturer: This is not a component; Code Arduino: This is not a component; Pin Count: 1
U3 = U0520-A.5: IC Cortex M33 250MHz, 4MB flash, 1.5MB RAM, TFBGA225 13x13mm; Manufacturer: ST; Code Arduino: U0520; Part Number: STM32H5F5LJH7Q
Y3 = X0035-A.2: CRYSTAL 48MHz tolerance 10ppm stability 15ppm load 10pF, shunt 2pF, ESR 30R, 3.2x2.5mm; Manufacturer: ECS; Load Capacitance: 8pF; ESR (Equivalent Series Resistance): 30; Code Arduino: X0035; Frequency Tolerance: 10ppm; Series Resistance: 30R; Frequency Stability: 15ppm; Part Number: ECS-480-8-33B2-CKM-TR3
Y4 = X0003-A.5: CRYSTAL 32.768kHz 20ppm 12.5pF SMD 1.6x0.9mm; Manufacturer: Citizen FineDevice; Frequency Stability: 0.12%; Code Arduino: 0213; Series Resistance: 70kR; Max Operating Temperature: 85°C; Load Capacitance: 12.5pF; Radiation Hardening: No; Frequency Tolerance: 20ppm; Min Operating Temperature: -40°C; Part Number: CM315D32768DZFT

## Sheet LED.SchDoc: LED
size A3; Author: Silvio Navaretti; CompanyName: ARDUINO; DrawnBy: Silvio Navaretti; Engineer: Silvio Navaretti; Organization: ARDUINO; SheetNumber: 14; SheetTotal: 51; RevAuthor: Silvio Navaretti
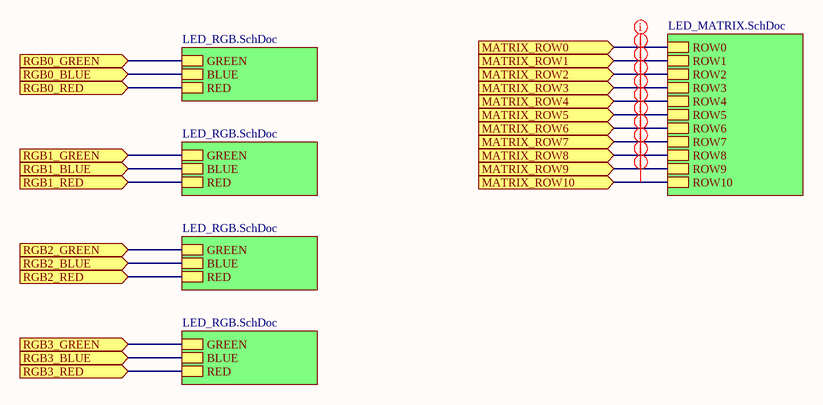
[diagram p38: LED.SchDoc]

### Sub-sheets
U_LED_MATRIX = LED_MATRIX.SchDoc: ROW0, ROW1, ROW2, ROW3, ROW4, ROW5, ROW6, ROW7, ROW8, ROW9, ROW10
U_LED_RGB = LED_RGB.SchDoc: GREEN, BLUE, RED
U_LED_RGB = LED_RGB.SchDoc: GREEN, BLUE, RED
U_LED_RGB = LED_RGB.SchDoc: GREEN, BLUE, RED
U_LED_RGB = LED_RGB.SchDoc: GREEN, BLUE, RED

### Ports
MATRIX_ROW0 (in), MATRIX_ROW1 (in), MATRIX_ROW2 (in), MATRIX_ROW3 (in), MATRIX_ROW4 (in), MATRIX_ROW5 (in), MATRIX_ROW6 (in), MATRIX_ROW7 (in), MATRIX_ROW8 (in), MATRIX_ROW9 (in), MATRIX_ROW10 (in), RGB0_BLUE (in), RGB0_GREEN (in), RGB0_RED (in), RGB1_BLUE (in), RGB1_GREEN (in), RGB1_RED (in), RGB2_BLUE (in), RGB2_GREEN (in), RGB2_RED (in), RGB3_BLUE (in), RGB3_GREEN (in), RGB3_RED (in)

### Nets
PC6: port RGB3_BLUE, sheet U_LED_RGB/BLUE
PD10: port RGB1_GREEN, sheet U_LED_RGB/GREEN
PD11: port RGB2_RED, sheet U_LED_RGB/RED
PG2: port RGB3_RED, sheet U_LED_RGB/RED
PG3: port RGB0_RED, sheet U_LED_RGB/RED
PG4: port RGB1_RED, sheet U_LED_RGB/RED
PG5: port RGB2_GREEN, sheet U_LED_RGB/GREEN
PG6: port RGB0_GREEN, sheet U_LED_RGB/GREEN
PG8: port RGB3_GREEN, sheet U_LED_RGB/GREEN
PH2: port MATRIX_ROW0, sheet U_LED_MATRIX/ROW0
PH3: port MATRIX_ROW1, sheet U_LED_MATRIX/ROW1
PH4: port MATRIX_ROW2, sheet U_LED_MATRIX/ROW2
PH5: port MATRIX_ROW3, sheet U_LED_MATRIX/ROW3
PH6: port MATRIX_ROW4, sheet U_LED_MATRIX/ROW4
PH7: port MATRIX_ROW5, sheet U_LED_MATRIX/ROW5
PH9: port MATRIX_ROW6, sheet U_LED_MATRIX/ROW6
PH10: port MATRIX_ROW7, sheet U_LED_MATRIX/ROW7
PH13: port MATRIX_ROW8, sheet U_LED_MATRIX/ROW8
PH14: port MATRIX_ROW9, sheet U_LED_MATRIX/ROW9
PH15: port MATRIX_ROW10, sheet U_LED_MATRIX/ROW10
PK0: port RGB2_BLUE, sheet U_LED_RGB/BLUE
PK1: port RGB1_BLUE, sheet U_LED_RGB/BLUE
PK2: port RGB0_BLUE, sheet U_LED_RGB/BLUE

### Layout directives
net class MICROCONTROLLER_MATRIX: PH2, PH3, PH4, PH5, PH6, PH7, PH9, PH10, PH13, PH14, PH15

### Notes on the sheet
- Title:
- ID:
- Date:
- Time:
- Version:
- Sheet
- of
- RevAuthor:
- Reference Designs ARE PROVIDED "AS IS" AND "WITH ALL FAULTS. Arduino SA DISCLAIMS ALL OTHER WARRANTIES, EXPRESS OR IMPLIED, REGARDING PRODUCTS, INCLUDING BUT NOT LIMITED TO, ANY IMPLIED WARRANTIES OF MERCHANTABILITY OR FITNESS FOR A PARTICULAR PURPOSE.
  Arduino SA may make changes to specifications and product descriptions at any time, without notice. The Customer must not rely on the absence or characteristics of any features or instructions marked "reserved" or "undefined".
  Arduino SA reserves these for future definition and shall have no responsibility whatsoever for conflicts or incompatibilities arising from future changes to them. The product information on the Web Site or Materials is subject to change without notice.
  Do not finalize a design with this info. ARDUINO and other Arduino brands and logos and Trademarks of Arduino SA. All Arduino SA Trademarks cannot be used without owner's formal permission.
- File:
- Author:

## Sheet LED_MATRIX.SchDoc: LED MATRIX
size A3; Author: Silvio Navaretti; CompanyName: ARDUINO; DrawnBy: Silvio Navaretti; Engineer: Silvio Navaretti; Organization: ARDUINO; SheetNumber: 40; SheetTotal: 41; RevAuthor: Silvio Navaretti
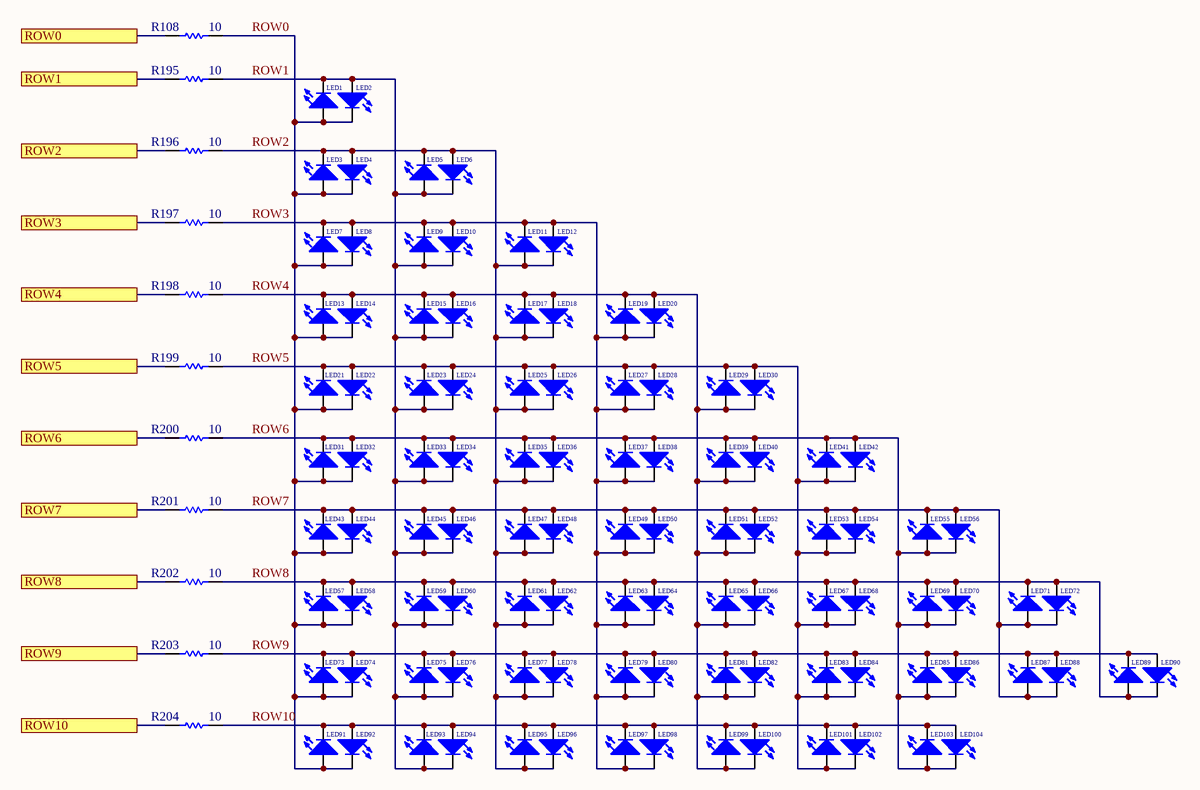
[diagram p39: LED_MATRIX.SchDoc]

### Parts
LED1  LTST-C191TBKT-5A  [LEDC1608X80N-AK]  (value not drawn)
LED2  LTST-C191TBKT-5A  [LEDC1608X80N-AK]  (value not drawn)
LED3  LTST-C191TBKT-5A  [LEDC1608X80N-AK]  (value not drawn)
LED4  LTST-C191TBKT-5A  [LEDC1608X80N-AK]  (value not drawn)
LED5  LTST-C191TBKT-5A  [LEDC1608X80N-AK]  (value not drawn)
LED6  LTST-C191TBKT-5A  [LEDC1608X80N-AK]  (value not drawn)
LED7  LTST-C191TBKT-5A  [LEDC1608X80N-AK]  (value not drawn)
LED8  LTST-C191TBKT-5A  [LEDC1608X80N-AK]  (value not drawn)
LED9  LTST-C191TBKT-5A  [LEDC1608X80N-AK]  (value not drawn)
LED10  LTST-C191TBKT-5A  [LEDC1608X80N-AK]  (value not drawn)
LED11  LTST-C191TBKT-5A  [LEDC1608X80N-AK]  (value not drawn)
LED12  LTST-C191TBKT-5A  [LEDC1608X80N-AK]  (value not drawn)
LED13  LTST-C191TBKT-5A  [LEDC1608X80N-AK]  (value not drawn)
LED14  LTST-C191TBKT-5A  [LEDC1608X80N-AK]  (value not drawn)
LED15  LTST-C191TBKT-5A  [LEDC1608X80N-AK]  (value not drawn)
LED16  LTST-C191TBKT-5A  [LEDC1608X80N-AK]  (value not drawn)
LED17  LTST-C191TBKT-5A  [LEDC1608X80N-AK]  (value not drawn)
LED18  LTST-C191TBKT-5A  [LEDC1608X80N-AK]  (value not drawn)
LED19  LTST-C191TBKT-5A  [LEDC1608X80N-AK]  (value not drawn)
LED20  LTST-C191TBKT-5A  [LEDC1608X80N-AK]  (value not drawn)
LED21  LTST-C191TBKT-5A  [LEDC1608X80N-AK]  (value not drawn)
LED22  LTST-C191TBKT-5A  [LEDC1608X80N-AK]  (value not drawn)
LED23  LTST-C191TBKT-5A  [LEDC1608X80N-AK]  (value not drawn)
LED24  LTST-C191TBKT-5A  [LEDC1608X80N-AK]  (value not drawn)
LED25  LTST-C191TBKT-5A  [LEDC1608X80N-AK]  (value not drawn)
LED26  LTST-C191TBKT-5A  [LEDC1608X80N-AK]  (value not drawn)
LED27  LTST-C191TBKT-5A  [LEDC1608X80N-AK]  (value not drawn)
LED28  LTST-C191TBKT-5A  [LEDC1608X80N-AK]  (value not drawn)
LED29  LTST-C191TBKT-5A  [LEDC1608X80N-AK]  (value not drawn)
LED30  LTST-C191TBKT-5A  [LEDC1608X80N-AK]  (value not drawn)
LED31  LTST-C191TBKT-5A  [LEDC1608X80N-AK]  (value not drawn)
LED32  LTST-C191TBKT-5A  [LEDC1608X80N-AK]  (value not drawn)
LED33  LTST-C191TBKT-5A  [LEDC1608X80N-AK]  (value not drawn)
LED34  LTST-C191TBKT-5A  [LEDC1608X80N-AK]  (value not drawn)
LED35  LTST-C191TBKT-5A  [LEDC1608X80N-AK]  (value not drawn)
LED36  LTST-C191TBKT-5A  [LEDC1608X80N-AK]  (value not drawn)
LED37  LTST-C191TBKT-5A  [LEDC1608X80N-AK]  (value not drawn)
LED38  LTST-C191TBKT-5A  [LEDC1608X80N-AK]  (value not drawn)
LED39  LTST-C191TBKT-5A  [LEDC1608X80N-AK]  (value not drawn)
LED40  LTST-C191TBKT-5A  [LEDC1608X80N-AK]  (value not drawn)
LED41  LTST-C191TBKT-5A  [LEDC1608X80N-AK]  (value not drawn)
LED42  LTST-C191TBKT-5A  [LEDC1608X80N-AK]  (value not drawn)
LED43  LTST-C191TBKT-5A  [LEDC1608X80N-AK]  (value not drawn)
LED44  LTST-C191TBKT-5A  [LEDC1608X80N-AK]  (value not drawn)
LED45  LTST-C191TBKT-5A  [LEDC1608X80N-AK]  (value not drawn)
LED46  LTST-C191TBKT-5A  [LEDC1608X80N-AK]  (value not drawn)
LED47  LTST-C191TBKT-5A  [LEDC1608X80N-AK]  (value not drawn)
LED48  LTST-C191TBKT-5A  [LEDC1608X80N-AK]  (value not drawn)
LED49  LTST-C191TBKT-5A  [LEDC1608X80N-AK]  (value not drawn)
LED50  LTST-C191TBKT-5A  [LEDC1608X80N-AK]  (value not drawn)
LED51  LTST-C191TBKT-5A  [LEDC1608X80N-AK]  (value not drawn)
LED52  LTST-C191TBKT-5A  [LEDC1608X80N-AK]  (value not drawn)
LED53  LTST-C191TBKT-5A  [LEDC1608X80N-AK]  (value not drawn)
LED54  LTST-C191TBKT-5A  [LEDC1608X80N-AK]  (value not drawn)
LED55  LTST-C191TBKT-5A  [LEDC1608X80N-AK]  (value not drawn)
LED56  LTST-C191TBKT-5A  [LEDC1608X80N-AK]  (value not drawn)
LED57  LTST-C191TBKT-5A  [LEDC1608X80N-AK]  (value not drawn)
LED58  LTST-C191TBKT-5A  [LEDC1608X80N-AK]  (value not drawn)
LED59  LTST-C191TBKT-5A  [LEDC1608X80N-AK]  (value not drawn)
LED60  LTST-C191TBKT-5A  [LEDC1608X80N-AK]  (value not drawn)
LED61  LTST-C191TBKT-5A  [LEDC1608X80N-AK]  (value not drawn)
LED62  LTST-C191TBKT-5A  [LEDC1608X80N-AK]  (value not drawn)
LED63  LTST-C191TBKT-5A  [LEDC1608X80N-AK]  (value not drawn)
LED64  LTST-C191TBKT-5A  [LEDC1608X80N-AK]  (value not drawn)
LED65  LTST-C191TBKT-5A  [LEDC1608X80N-AK]  (value not drawn)
LED66  LTST-C191TBKT-5A  [LEDC1608X80N-AK]  (value not drawn)
LED67  LTST-C191TBKT-5A  [LEDC1608X80N-AK]  (value not drawn)
LED68  LTST-C191TBKT-5A  [LEDC1608X80N-AK]  (value not drawn)
LED69  LTST-C191TBKT-5A  [LEDC1608X80N-AK]  (value not drawn)
LED70  LTST-C191TBKT-5A  [LEDC1608X80N-AK]  (value not drawn)
LED71  LTST-C191TBKT-5A  [LEDC1608X80N-AK]  (value not drawn)
LED72  LTST-C191TBKT-5A  [LEDC1608X80N-AK]  (value not drawn)
LED73  LTST-C191TBKT-5A  [LEDC1608X80N-AK]  (value not drawn)
LED74  LTST-C191TBKT-5A  [LEDC1608X80N-AK]  (value not drawn)
LED75  LTST-C191TBKT-5A  [LEDC1608X80N-AK]  (value not drawn)
LED76  LTST-C191TBKT-5A  [LEDC1608X80N-AK]  (value not drawn)
LED77  LTST-C191TBKT-5A  [LEDC1608X80N-AK]  (value not drawn)
LED78  LTST-C191TBKT-5A  [LEDC1608X80N-AK]  (value not drawn)
LED79  LTST-C191TBKT-5A  [LEDC1608X80N-AK]  (value not drawn)
LED80  LTST-C191TBKT-5A  [LEDC1608X80N-AK]  (value not drawn)
LED81  LTST-C191TBKT-5A  [LEDC1608X80N-AK]  (value not drawn)
LED82  LTST-C191TBKT-5A  [LEDC1608X80N-AK]  (value not drawn)
LED83  LTST-C191TBKT-5A  [LEDC1608X80N-AK]  (value not drawn)
LED84  LTST-C191TBKT-5A  [LEDC1608X80N-AK]  (value not drawn)
LED85  LTST-C191TBKT-5A  [LEDC1608X80N-AK]  (value not drawn)
LED86  LTST-C191TBKT-5A  [LEDC1608X80N-AK]  (value not drawn)
LED87  LTST-C191TBKT-5A  [LEDC1608X80N-AK]  (value not drawn)
LED88  LTST-C191TBKT-5A  [LEDC1608X80N-AK]  (value not drawn)
LED89  LTST-C191TBKT-5A  [LEDC1608X80N-AK]  (value not drawn)
LED90  LTST-C191TBKT-5A  [LEDC1608X80N-AK]  (value not drawn)
LED91  LTST-C191TBKT-5A  [LEDC1608X80N-AK]  (value not drawn)
LED92  LTST-C191TBKT-5A  [LEDC1608X80N-AK]  (value not drawn)
LED93  LTST-C191TBKT-5A  [LEDC1608X80N-AK]  (value not drawn)
LED94  LTST-C191TBKT-5A  [LEDC1608X80N-AK]  (value not drawn)
LED95  LTST-C191TBKT-5A  [LEDC1608X80N-AK]  (value not drawn)
LED96  LTST-C191TBKT-5A  [LEDC1608X80N-AK]  (value not drawn)
LED97  LTST-C191TBKT-5A  [LEDC1608X80N-AK]  (value not drawn)
LED98  LTST-C191TBKT-5A  [LEDC1608X80N-AK]  (value not drawn)
LED99  LTST-C191TBKT-5A  [LEDC1608X80N-AK]  (value not drawn)
LED100  LTST-C191TBKT-5A  [LEDC1608X80N-AK]  (value not drawn)
LED101  LTST-C191TBKT-5A  [LEDC1608X80N-AK]  (value not drawn)
LED102  LTST-C191TBKT-5A  [LEDC1608X80N-AK]  (value not drawn)
LED103  LTST-C191TBKT-5A  [LEDC1608X80N-AK]  (value not drawn)
LED104  LTST-C191TBKT-5A  [LEDC1608X80N-AK]  (value not drawn)
R108  value 10  [RES-0402]  (hidden comment: RC0402FR-0710RL)
R195  value 10  [RES-0402]  (hidden comment: RC0402FR-0710RL)
R196  value 10  [RES-0402]  (hidden comment: RC0402FR-0710RL)
R197  value 10  [RES-0402]  (hidden comment: RC0402FR-0710RL)
R198  value 10  [RES-0402]  (hidden comment: RC0402FR-0710RL)
R199  value 10  [RES-0402]  (hidden comment: RC0402FR-0710RL)
R200  value 10  [RES-0402]  (hidden comment: RC0402FR-0710RL)
R201  value 10  [RES-0402]  (hidden comment: RC0402FR-0710RL)
R202  value 10  [RES-0402]  (hidden comment: RC0402FR-0710RL)
R203  value 10  [RES-0402]  (hidden comment: RC0402FR-0710RL)
R204  value 10  [RES-0402]  (hidden comment: RC0402FR-0710RL)

### Ports
ROW0, ROW1, ROW2, ROW3, ROW4, ROW5, ROW6, ROW7, ROW8, ROW9, ROW10

### Nets
PH2: R108.2 ; port ROW0
PH3: R195.2 ; port ROW1
PH4: R196.2 ; port ROW2
PH5: R197.2 ; port ROW3
PH6: R198.2 ; port ROW4
PH7: R199.2 ; port ROW5
PH9: R200.2 ; port ROW6
PH10: R201.2 ; port ROW7
PH13: R202.2 ; port ROW8
PH14: R203.2 ; port ROW9
PH15: R204.2 ; port ROW10
ROW0: LED1.A LED2.C LED3.A LED4.C LED7.A LED8.C LED13.A LED14.C LED21.A LED22.C LED31.A LED32.C LED43.A LED44.C LED57.A LED58.C LED73.A LED74.C LED91.A LED92.C R108.1  [project net ROW0_40]
ROW1: LED1.C LED2.A LED5.A LED6.C LED9.A LED10.C LED15.A LED16.C LED23.A LED24.C LED33.A LED34.C LED45.A LED46.C LED59.A LED60.C LED75.A LED76.C LED93.A LED94.C R195.1  [project net ROW1_40]
ROW2: LED3.C LED4.A LED5.C LED6.A LED11.A LED12.C LED17.A LED18.C LED25.A LED26.C LED35.A LED36.C LED47.A LED48.C LED61.A LED62.C LED77.A LED78.C LED95.A LED96.C R196.1  [project net ROW2_40]
ROW3: LED7.C LED8.A LED9.C LED10.A LED11.C LED12.A LED19.A LED20.C LED27.A LED28.C LED37.A LED38.C LED49.A LED50.C LED63.A LED64.C LED79.A LED80.C LED97.A LED98.C R197.1  [project net ROW3_40]
ROW4: LED13.C LED14.A LED15.C LED16.A LED17.C LED18.A LED19.C LED20.A LED29.A LED30.C LED39.A LED40.C LED51.A LED52.C LED65.A LED66.C LED81.A LED82.C LED99.A LED100.C R198.1  [project net ROW4_40]
ROW5: LED21.C LED22.A LED23.C LED24.A LED25.C LED26.A LED27.C LED28.A LED29.C LED30.A LED41.A LED42.C LED53.A LED54.C LED67.A LED68.C LED83.A LED84.C LED101.A LED102.C R199.1  [project net ROW5_40]
ROW6: LED31.C LED32.A LED33.C LED34.A LED35.C LED36.A LED37.C LED38.A LED39.C LED40.A LED41.C LED42.A LED55.A LED56.C LED69.A LED70.C LED85.A LED86.C LED103.A LED104.C R200.1  [project net ROW6_40]
ROW7: LED43.C LED44.A LED45.C LED46.A LED47.C LED48.A LED49.C LED50.A LED51.C LED52.A LED53.C LED54.A LED55.C LED56.A LED71.A LED72.C LED87.A LED88.C R201.1  [project net ROW7_40]
ROW8: LED57.C LED58.A LED59.C LED60.A LED61.C LED62.A LED63.C LED64.A LED65.C LED66.A LED67.C LED68.A LED69.C LED70.A LED71.C LED72.A LED89.A LED90.C R202.1  [project net ROW8_40]
ROW9: LED73.C LED74.A LED75.C LED76.A LED77.C LED78.A LED79.C LED80.A LED81.C LED82.A LED83.C LED84.A LED85.C LED86.A LED87.C LED88.A LED89.C LED90.A R203.1  [project net ROW9_40]
ROW10: LED91.C LED92.A LED93.C LED94.A LED95.C LED96.A LED97.C LED98.A LED99.C LED100.A LED101.C LED102.A LED103.C LED104.A R204.1  [project net ROW10_40]

### Notes on the sheet
- Title:
- ID:
- Date:
- Time:
- Version:
- Sheet
- of
- RevAuthor:
- Reference Designs ARE PROVIDED "AS IS" AND "WITH ALL FAULTS. Arduino SA DISCLAIMS ALL OTHER WARRANTIES, EXPRESS OR IMPLIED, REGARDING PRODUCTS, INCLUDING BUT NOT LIMITED TO, ANY IMPLIED WARRANTIES OF MERCHANTABILITY OR FITNESS FOR A PARTICULAR PURPOSE.
  Arduino SA may make changes to specifications and product descriptions at any time, without notice. The Customer must not rely on the absence or characteristics of any features or instructions marked "reserved" or "undefined".
  Arduino SA reserves these for future definition and shall have no responsibility whatsoever for conflicts or incompatibilities arising from future changes to them. The product information on the Web Site or Materials is subject to change without notice.
  Do not finalize a design with this info. ARDUINO and other Arduino brands and logos and Trademarks of Arduino SA. All Arduino SA Trademarks cannot be used without owner's formal permission.
- File:
- Author:

### Library data of the parts
LED1-LED104 = L0040-A.2: LED SMD 0603 BLUE 468nm, water clear, 11-45 mcd, 138 deg; Manufacturer: Liteon; Code Arduino: L0040; Part Number: LTST-C191TBKT-5A
R108 R195-R204 = R0170-A.23: RES CHIP 0402 10R 1% 1/16W; Manufacturer: YAGEO; Code Arduino: R0170; Power: 62.5mW; Temperature coefficient: 200ppm; Part Number: RC0402FR-0710RL; Tolerance: 1%; Case Code (Imperial): 0402; Technology: Thick film

## Sheet LED_RGB.SchDoc: LED RGB
size A3; Author: Silvio Navaretti; CompanyName: ARDUINO; DrawnBy: Silvio Navaretti; Engineer: Silvio Navaretti; Organization: ARDUINO; SheetNumber: 16; SheetTotal: 51; RevAuthor: Silvio Navaretti
Used 4 times, as channels U_MICROCONTROLLER/U_LED/U_LED_RGB, U_MICROCONTROLLER/U_LED/U_LED_RGB, U_MICROCONTROLLER/U_LED/U_LED_RGB, U_MICROCONTROLLER/U_LED/U_LED_RGB. Parts and nets are listed once, with the designators drawn on the sheet.
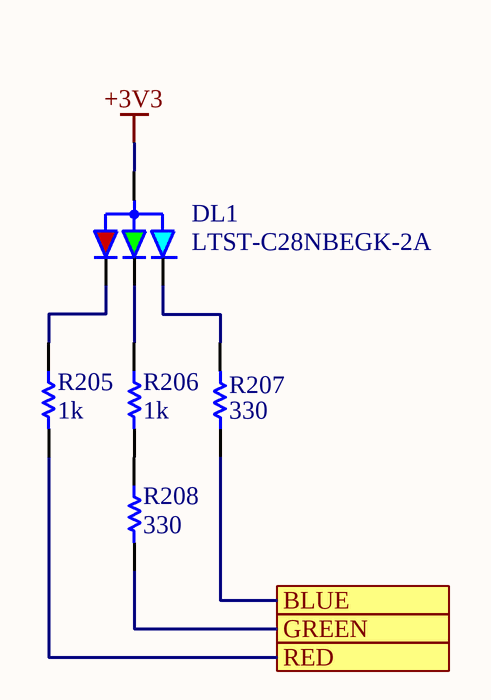
[diagram p40: LED_RGB.SchDoc]

### Parts
DL1  LTST-C28NBEGK-2A  [SMLP34RGB2W]
R205  value 1k  [RES-0201]  (hidden comment: RC0201FR-071KL)
R206  value 1k  [RES-0201]  (hidden comment: RC0201FR-071KL)
R207  value 330  [RES-0201]  (hidden comment: AC0201FR-07330RL)
R208  value 330  [RES-0201]  (hidden comment: AC0201FR-07330RL)

### Ports
BLUE, GREEN, RED

### Nets
+3V3: DL1.1(ANODE)
BLUE: R207.1 ; port BLUE
GREEN: R208.2 ; port GREEN
RED: R205.2 ; port RED
NetDL1_2: DL1.2(RED_C) R205.1
NetDL1_3: DL1.3(BLUE_C) R207.2
NetDL1_4: DL1.4(GREEN_C) R206.1
NetR206_2: R206.2 R208.1

### Channels
U_MICROCONTROLLER/U_LED/U_LED_RGB: designators end in _1; ports BLUE=PK2 GREEN=PG6 RED=PG3
U_MICROCONTROLLER/U_LED/U_LED_RGB: designators end in _2; ports BLUE=PK1 GREEN=PD10 RED=PG4
U_MICROCONTROLLER/U_LED/U_LED_RGB: designators end in _3; ports BLUE=PK0 GREEN=PG5 RED=PD11
U_MICROCONTROLLER/U_LED/U_LED_RGB: designators end in _4; ports BLUE=PC6 GREEN=PG8 RED=PG2

### Notes on the sheet
- Title:
- ID:
- Date:
- Time:
- Version:
- Sheet
- of
- RevAuthor:
- Reference Designs ARE PROVIDED "AS IS" AND "WITH ALL FAULTS. Arduino SA DISCLAIMS ALL OTHER WARRANTIES, EXPRESS OR IMPLIED, REGARDING PRODUCTS, INCLUDING BUT NOT LIMITED TO, ANY IMPLIED WARRANTIES OF MERCHANTABILITY OR FITNESS FOR A PARTICULAR PURPOSE.
  Arduino SA may make changes to specifications and product descriptions at any time, without notice. The Customer must not rely on the absence or characteristics of any features or instructions marked "reserved" or "undefined".
  Arduino SA reserves these for future definition and shall have no responsibility whatsoever for conflicts or incompatibilities arising from future changes to them. The product information on the Web Site or Materials is subject to change without notice.
  Do not finalize a design with this info. ARDUINO and other Arduino brands and logos and Trademarks of Arduino SA. All Arduino SA Trademarks cannot be used without owner's formal permission.
- File:
- Author:

### Library data of the parts
DL1 = L0014-A.13: LED RGB DIFFUSED PICOLED SMD; Manufacturer: Liteon; Dominant Wavelength: 470nm; Forward Current: 20mA; Code Arduino: A5469; Luminous Intensity: 45mcd; Forward Voltage: 3V; Lens Color: White; Lens Style: Rectangular; Test Current: 5mA; Length: 1mm; Color: Blue,Green,Red; Part Number: LTST-C28NBEGK-2A; Width: 1mm; Pin Count: 4; Lens Transparency: Diffused; Case Code (Imperial): 0404; Min Operating Temperature: -40°C; Height: 0.25mm; Max Operating Temperature: 85°C
R205 R206 = R0195-A.22: as R412 on sheet MICROCONTROLLER; Part Number: RC0201FR-071KL; Tolerance: 1%; Case Code (Imperial): 0201; Technology: Thick film
R207 = R0149-A.21: RES CHIP 0201 330R 1% 1/20W; Manufacturer: Yageo; Power: 50mW; Code Arduino: R0149; Temperature coefficient: 200ppm; Case Code (Imperial): 0201; Manufacturer 2: Samsung Electro-Mechanics; Tolerance: 1%; Part Number: AC0201FR-07330RL; Technology: Thick film
R208 = R0149-A.21: RES CHIP 0201 330R 1% 1/20W; Manufacturer: Yageo; Power: 50mW; Temperature coefficient: 200ppm; Code Arduino: R0149; Part Number: AC0201FR-07330RL; Tolerance: 1%; Case Code (Imperial): 0201; Technology: Thick film; Manufacturer 2: Samsung Electro-Mechanics